# Altium schematic sheet Master_Controller.SchDoc: Master Controller
size Tabloid; PageSetup: Record=PageOptions|CenterHorizontal=True|CenterVertical=True|PrintScale=0.64|XCorrection=1.00|YCorrection=1.00|PrintKind=1|BorderSize=5000000|LeftOffset=0|BottomOffset=0|Orientation=2|PaperLength=1000|PaperWidth=1000|Scale=100|PaperSource=7|PrintQuality=-3|MediaType=1|DitherType=10|PrintScaleMode=1|PaperKind=Letter|PaperIndex=1; Organization: Midnight Sun Solar Rayce Car Team; Address1: University of Waterloo; Address2: 200 University Ave W; Address3: Waterloo, ON, Canada; Address4: N2L 3E9; SheetNumber: 3; SheetTotal: 3; Website: www.uwmidsun.com
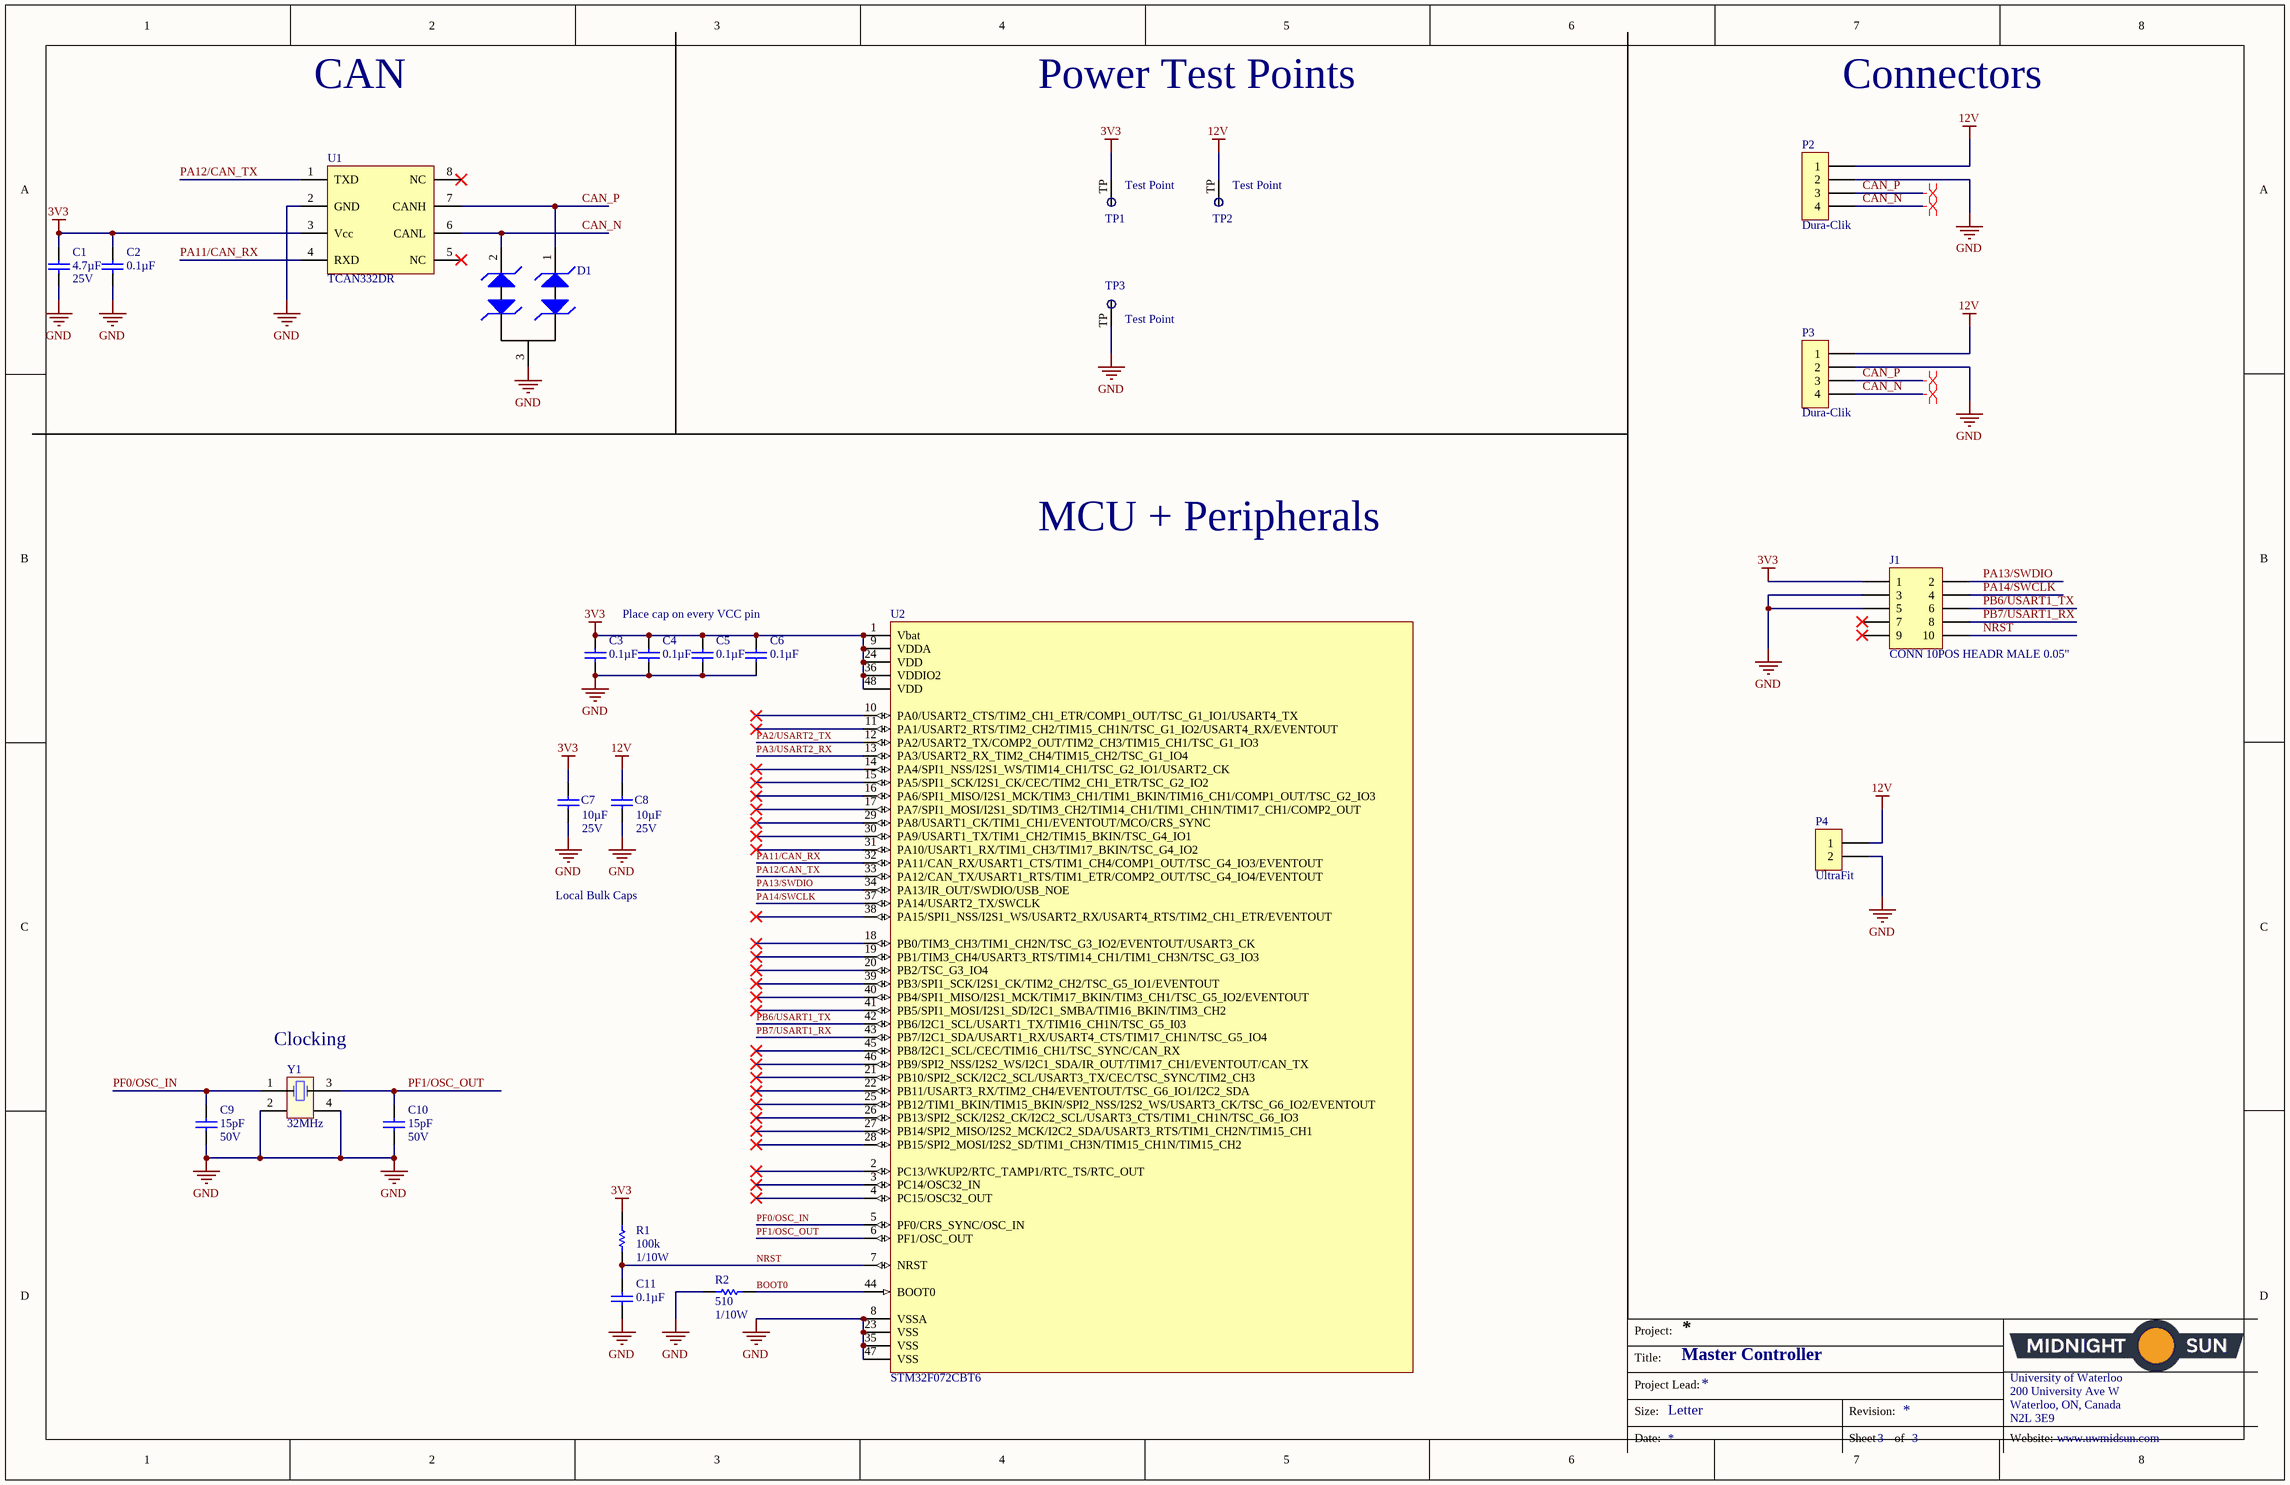
[diagram p0: Master_Controller.SchDoc]

## Parts
C1  Voltage: 25V  Capacitance: 4.7µF  [CAP, 0603]  (hidden comment: CAP CER 4.7UF 25V 10% X5R 0603)
C2  Capacitance: 0.1µF  [CAP, 0603]  (hidden comment: CAP CER 0.1UF 50V 10% X7R 0603)
C3  Capacitance: 0.1µF  [CAP, 0603]  (hidden comment: CAP CER 0.1UF 50V 10% X7R 0603)
C4  Capacitance: 0.1µF  [CAP, 0603]  (hidden comment: CAP CER 0.1UF 50V 10% X7R 0603)
C5  Capacitance: 0.1µF  [CAP, 0603]  (hidden comment: CAP CER 0.1UF 50V 10% X7R 0603)
C6  Capacitance: 0.1µF  [CAP, 0603]  (hidden comment: CAP CER 0.1UF 50V 10% X7R 0603)
C7  Voltage - Rated: 25V  Capacitance: 10µF  [CAP, 0805]  (hidden comment: CAP CER 10uF 25V 10% X5R 0805)
C8  Voltage - Rated: 25V  Capacitance: 10µF  [CAP, 0805]  (hidden comment: CAP CER 10uF 25V 10% X5R 0805)
C9  Voltage: 50V  Capacitance: 15pF  [CAP, 0603]  (hidden comment: CAP CER 15PF 50V ±5% NPO 0603)
C10  Voltage: 50V  Capacitance: 15pF  [CAP, 0603]  (hidden comment: CAP CER 15PF 50V ±5% NPO 0603)
C11  Capacitance: 0.1µF  [CAP, 0603]  (hidden comment: CAP CER 0.1UF 50V 10% X7R 0603)
D1  DIODE TVS 24VWM 70VC SOT23  [SOT23]  (value not drawn)
J1  CONN 10POS HEADR MALE 0.05"  [CONN, 10POS 0.05" Debug Header]
P2  Dura-Clik  [CONN, 4POS DURA-CLIK VERT]
P3  Dura-Clik  [CONN, 4POS DURA-CLIK VERT]
P4  Series: UltraFit  [CONN, 2POS ULTRA-FIT]  (hidden comment: CONN 2POS ULTRA-FIT 0.138")
R1  Resistance: 100k  Power: 1/10W  [RES, 0603]  (hidden comment: RES 100K OHM 5% 1/8W 0603)
R2  Resistance: 510  Power: 1/10W  [RES, 0603]  (hidden comment: RES 510 OHM 5% 1/10W 0603)
TP1  Test Point  [Test Point]
TP2  Test Point  [Test Point]
TP3  Test Point  [Test Point]
U1  Manufacturer Part Number: TCAN332DR  [TSOP65P280X145-8N]  (hidden comment: IC CAN Tranceiver TCAN332DR)
U2  Manufacturer Part Number 1: STM32F072CBT6  [TSQFP50P890X890X160-48M]  (hidden comment: IC MCU 32BIT 128KB FLASH 48LQFP)
Y1  Frequency: 32MHz  [CX2520DB CRYSTAL]  (hidden comment: CRYSTAL 32 MHz 8pF 4-SMD)

## Nets
3V3: C1.2 C2.2 C3.2 C4.2 C5.2 C6.2 C7.1 J1.1 R1.2 TP1.TP U1.3(Vcc) U2.1(Vbat) U2.9(VDDA) U2.24(VDD) U2.36(VDDIO2) U2.48(VDD)
12V: C8.1 P2.1 P3.1 P4.1 TP2.TP
GND: C1.1 C2.1 C3.1 C4.1 C5.1 C6.1 C7.2 C8.2 C9.1 C10.1 C11.1 D1.3(Common_Cathode) J1.3 J1.5 P2.2 P3.2 P4.2 R2.1 TP3.TP U1.2(GND) U2.8(VSSA) U2.23(VSS) U2.35(VSS) U2.47(VSS) Y1.2 Y1.4
BOOT0: R2.2 U2.44(BOOT0)
CAN_N: D1.2(Cathode2) P2.4 P3.4 U1.6(CANL)
CAN_P: D1.1(Cathode1) P2.3 P3.3 U1.7(CANH)
NRST: C11.2 J1.10 R1.1 U2.7(NRST)
PA2/USART2_TX: U2.12(PA2/USART2_TX/COMP2_OUT/TIM2_CH3/TIM15_CH1/TSC_G1_IO3)
PA3/USART2_RX: U2.13(PA3/USART2_RX_TIM2_CH4/TIM15_CH2/TSC_G1_IO4)
PA11/CAN_RX: U1.4(RXD) U2.32(PA11/CAN_RX/USART1_CTS/TIM1_CH4/COMP1_OUT/TSC_G4_IO3/EVENTOUT)
PA12/CAN_TX: U1.1(TXD) U2.33(PA12/CAN_TX/USART1_RTS/TIM1_ETR/COMP2_OUT/TSC_G4_IO4/EVENTOUT)
PA13/SWDIO: J1.2 U2.34(PA13/IR_OUT/SWDIO/USB_NOE)
PA14/SWCLK: J1.4 U2.37(PA14/USART2_TX/SWCLK)
PB6/USART1_TX: J1.6 U2.42(PB6/I2C1_SCL/USART1_TX/TIM16_CH1N/TSC_G5_I03)
PB7/USART1_RX: J1.8 U2.43(PB7/I2C1_SDA/USART1_RX/USART4_CTS/TIM17_CH1N/TSC_G5_IO4)
PF0/OSC_IN: C9.2 U2.5(PF0/CRS_SYNC/OSC_IN) Y1.1(OSC1)
PF1/OSC_OUT: C10.2 U2.6(PF1/OSC_OUT) Y1.3(OSC2)

Not connected (* = marked no-connect by the designer): J1 7* 9*; U1 5(NC)* 8(NC)*; U2 2(PC13/WKUP2/RTC_TAMP1/RTC_TS/RTC_OUT)* 3(PC14/OSC32_IN)* 4(PC15/OSC32_OUT)* 10(PA0/USART2_CTS/TIM2_CH1_ETR/COMP1_OUT/TSC_G1_IO1/USART4_TX)* 11(PA1/USART2_RTS/TIM2_CH2/TIM15_CH1N/TSC_G1_IO2/USART4_RX/EVENTOUT)* 14(PA4/SPI1_NSS/I2S1_WS/TIM14_CH1/TSC_G2_IO1/USART2_CK)* 15(PA5/SPI1_SCK/I2S1_CK/CEC/TIM2_CH1_ETR/TSC_G2_IO2)* 16(PA6/SPI1_MISO/I2S1_MCK/TIM3_CH1/TIM1_BKIN/TIM16_CH1/COMP1_OUT/TSC_G2_IO3)* 17(PA7/SPI1_MOSI/I2S1_SD/TIM3_CH2/TIM14_CH1/TIM1_CH1N/TIM17_CH1/COMP2_OUT)* 18(PB0/TIM3_CH3/TIM1_CH2N/TSC_G3_IO2/EVENTOUT/USART3_CK)* 19(PB1/TIM3_CH4/USART3_RTS/TIM14_CH1/TIM1_CH3N/TSC_G3_IO3)* 20(PB2/TSC_G3_IO4)* 21(PB10/SPI2_SCK/I2C2_SCL/USART3_TX/CEC/TSC_SYNC/TIM2_CH3)* 22(PB11/USART3_RX/TIM2_CH4/EVENTOUT/TSC_G6_IO1/I2C2_SDA)* 25(PB12/TIM1_BKIN/TIM15_BKIN/SPI2_NSS/I2S2_WS/USART3_CK/TSC_G6_IO2/EVENTOUT)* 26(PB13/SPI2_SCK/I2S2_CK/I2C2_SCL/USART3_CTS/TIM1_CH1N/TSC_G6_IO3)* 27(PB14/SPI2_MISO/I2S2_MCK/I2C2_SDA/USART3_RTS/TIM1_CH2N/TIM15_CH1)* 28(PB15/SPI2_MOSI/I2S2_SD/TIM1_CH3N/TIM15_CH1N/TIM15_CH2)* 29(PA8/USART1_CK/TIM1_CH1/EVENTOUT/MCO/CRS_SYNC)* 30(PA9/USART1_TX/TIM1_CH2/TIM15_BKIN/TSC_G4_IO1)* 31(PA10/USART1_RX/TIM1_CH3/TIM17_BKIN/TSC_G4_IO2)* 38(PA15/SPI1_NSS/I2S1_WS/USART2_RX/USART4_RTS/TIM2_CH1_ETR/EVENTOUT)* 39(PB3/SPI1_SCK/I2S1_CK/TIM2_CH2/TSC_G5_IO1/EVENTOUT)* 40(PB4/SPI1_MISO/I2S1_MCK/TIM17_BKIN/TIM3_CH1/TSC_G5_IO2/EVENTOUT)* 41(PB5/SPI1_MOSI/I2S1_SD/I2C1_SMBA/TIM16_BKIN/TIM3_CH2)* 45(PB8/I2C1_SCL/CEC/TIM16_CH1/TSC_SYNC/CAN_RX)* 46(PB9/SPI2_NSS/I2S2_WS/I2C1_SDA/IR_OUT/TIM17_CH1/EVENTOUT/CAN_TX)*

## Layout directives
differential pair: CAN_N, CAN_P

## Notes on the sheet
- CAN
- Power Test Points
- Connectors
- MCU + Peripherals
- Place cap on every VCC pin
- Local Bulk Caps
- (near Y1) Clocking
- Project:
- Title:
- Size:
- Project Lead:
- Letter
- Revision:
- University of Waterloo
- 200 University Ave W
- Waterloo, ON, Canada
- N2L 3E9
- Date:
- Sheet
- of
- Website:

## Library data of the parts
C1 = CAP CER 4.7UF 25V 10% X5R 0603: 4.7µF ±10% 25V Ceramic Capacitor X5R 0603 (1608 Metric); Manufacturer 1: Murata Electronics North America; Manufacturer Part Number 1: GRM188R61E475KE11D; Supplier 1: Digi-Key; Supplier Part Number 1: 490-7203-1-ND; Packaging: Cut Tape (CT); Part Status: Active; Operating Temperature: -55°C ~ 85°C; Ratings: -; Mounting Type: Surface Mount, MLCC; Package / Case: 0603 (1608 Metric); Size / Dimension: 0.063" L x 0.031" W (1.60mm x 0.80mm); Height - Seated (Max): -; Thickness (Max): 0.031" (0.80mm); Lead Spacing: -; Lead Style: -; ComponentLink1URL: http://www.murata.com/~/media/webrenewal/support/library/catalog/products/capacitor/mlcc/c02e.ashx; ComponentLink1Description: http://www.murata.com/~/media/webrenewal/support/library/catalog/products/capacitor/mlcc/c02e.ashx; Tolerance: ±10%; Temperature Coefficient: X5R
C2-C6 C11 = CAP CER 0.1UF 50V 10% X7R 0603: 0.10µF ±10% 50V Ceramic Capacitor X7R 0603 (1608 Metric); Manufacturer 1: AVX Corporation; Manufacturer Part Number 1: 06035C104KAT2A; Voltage: 50V; Supplier 1: Digi-Key; Supplier Part Number 1: 478-5052-1-ND; Packaging: Cut Tape (CT); Part Status: Active; Operating Temperature: -55°C ~ 125°C; Ratings: -; Mounting Type: Surface Mount, MLCC; Package / Case: 0603 (1608 Metric); Size / Dimension: 0.063" L x 0.032" W (1.60mm x 0.81mm); Height - Seated (Max): -; Thickness (Max): 0.035" (0.90mm); Lead Spacing: -; Lead Style: -; ComponentLink1URL: http://datasheets.avx.com/X7RDielectric.pdf; ComponentLink1Description: http://datasheets.avx.com/X7RDielectric.pdf; Tolerance: ±10%; Temperature Coefficient: X7R
C7 C8 = CAP CER 10uF 25V 10% X5R 0805: 10µF ±10% 25V Ceramic Capacitor X5R 0805 (2012 Metric); Manufacturer: Murata Electronics North America; Manufacturer Part Number: GRM21BR61E106KA73L; Supplier 1: Digi-Key; RoHS: RoHS Compliant; Category: Capacitors; Stock 1: 1695157; Packaging: Cut Tape (CT); Part Status: Active; Tolerance: ±10%; Temperature Coefficient: X5R; Operating Temperature: -55°C ~ 85°C; Features: -; Ratings: -; Applications: General Purpose; Mounting Type: Surface Mount, MLCC; Package / Case: 0805 (2012 Metric); Size / Dimension: 0.079" L x 0.049" W (2.00mm x 1.25mm); Height - Seated (Max): -; Thickness (Max): 0.053" (1.35mm); Lead Spacing: -; Lead Style: -; ComponentLink1URL: http://search.murata.co.jp/Ceramy/image/img/A01X/G101/ENG/GRM21BR61E106KA73-01.pdf; ComponentLink1Description: http://search.murata.co.jp/Ceramy/image/img/A01X/G101/ENG/GRM21BR61E106KA73-01.pdf; Supplier Part Number 1: 490-5523-1-ND; Pricing 1: 1=0.3, 10=0.214, 100=0.1008, 500=0.07068, 1000=0.05851 (CAD)
C9 C10 = CAP CER 15PF 50V ±5% NPO 0603: 15pF ±5% 50V Ceramic Capacitor C0G, NP0 0603 (1608 Metric); Manufacturer 1: Yageo; Manufacturer Part Number 1: CC0603JRNPO9BN150; Supplier 1: Digi-Key; Supplier Part Number 1: 311-1060-1-ND; Packaging: Cut Tape (CT); Part Status: Active; Operating Temperature: -55°C ~ 125°C; Ratings: -; Failure Rate: -; Mounting Type: Surface Mount, MLCC; Package / Case: 0603 (1608 Metric); Size / Dimension: 0.063" L x 0.031" W (1.60mm x 0.80mm); Height - Seated (Max): -; Thickness (Max): 0.035" (0.90mm); Lead Spacing: -; Lead Style: -; ComponentLink1URL: http://www.yageo.com/documents/recent/UPY-GP_NP0_16V-to-50V_16.pdf; ComponentLink1Description: http://www.yageo.com/documents/recent/UPY-GP_NP0_16V-to-50V_16.pdf; Tolerance: ±5%; Temperature Coefficient: C0G, NP0
D1 = DIODE TVS 24VWM 70VC SOT23: TVS DIODE 24VWM 70VC SOT23; Manufacturer 1: Nexperia USA Inc.; Manufacturer Part Number 1: PESD1CAN,215; Type: Zener; Voltage - Breakdown (Min): 25.4V; Voltage - Clamping (Max) @ Ipp: 70V; Current - Peak Pulse (10/1000µs): 3A (8/20µs); Power - Peak Pulse: 200W; Power Line Protection: No; Capacitance @ Frequency: 11pF @ 1MHz; Supplier 1: Digi-Key; Supplier Part Number 1: 1727-3817-1-ND; Packaging: Cut Tape (CT); Part Status: Active; Operating Temperature: -65°C ~ 150°C (TA); Mounting Type: Surface Mount; Package / Case: TO-236-3, SC-59, SOT-23-3; Supplier Device Package: SOT-23 (TO-236AB); ComponentLink1URL: http://assets.nexperia.com/documents/data-sheet/PESD1CAN.pdf; ComponentLink1Description: http://assets.nexperia.com/documents/data-sheet/PESD1CAN.pdf
J1 = CONN 10POS HEADR MALE 0.05": 10 Positions Header Connector 0.050" (1.27mm) Surface Mount Gold; Manufacturer 1: Amphenol FCI; Manufacturer Part Number 1: 20021121-00010C4LF; Style: Board to Board; Shrouding: Unshrouded; Number of Positions: 10; Number of Positions Loaded: All; Contact Length - Mating: 0.120" (3.05mm); Material Flammability Rating: UL94 V-0; Supplier 1: Digi-Key; Supplier Part Number 1: 609-3695-1-ND; Packaging: Cut Tape (CT); Part Status: Active; Connector Type: Header; Contact Type: Male Pin; Number of Rows: 2; Row Spacing - Mating: 0.050" (1.27mm); Mounting Type: Surface Mount; Termination: Solder; Fastening Type: -; Contact Length - Post: -; Overall Contact Length: -; Insulation Height: -; Contact Shape: Square; Contact Finish - Mating: Gold; Contact Finish Thickness - Mating: 10µin (0.25µm); Contact Finish - Post: Tin; Contact Material: Copper Alloy; Insulation Material: Thermoplastic; Operating Temperature: -; Ingress Protection: -; Insulation Color: Black; Current Rating: -; Mated Stacking Heights: -; Contact Finish Thickness - Post: 50µin (1.27µm); ComponentLink1URL: http://portal.fciconnect.com/Comergent//fci/drawing/20021121.pdf; ComponentLink1Description: http://portal.fciconnect.com/Comergent//fci/drawing/20021121.pdf; Voltage: -; Pitch - Mating: 0.050" (1.27mm)
P2 P3 = CONN 4POS DURA-CLIK 0.079": 4 Positions Header Connector 0.079" (2.00mm) Surface Mount Tin; Manufacturer: Molex, LLC; Manufacturer Part Number: 5600200420; Style: Board to Cable/Wire; Shrouding: Shrouded - 4 Wall; Number of Positions: 4; Number of Positions Loaded: All; Mated Stacking Heights: 9.3mm; Supplier 1: Digi-Key; RoHS: RoHS Compliant; Category: Connectors, Interconnects; Stock 1: 9367; Pricing 1: 1=2.23, 10=2.022, 25=1.898, 50=1.8156, 100=1.733 (CAD); Packaging: Cut Tape (CT); Part Status: Active; Connector Type: Header; Contact Type: Male Pin; Pitch - Mating: 0.079" (2.00mm); Number of Rows: 1; Row Spacing - Mating: -; Mounting Type: Surface Mount; Termination: Solder; Fastening Type: Latch Lock; Contact Length - Mating: -; Contact Length - Post: -; Overall Contact Length: -; Insulation Height: 0.315" (8.00mm); Contact Shape: Square; Contact Finish - Mating: Tin; Contact Finish Thickness - Mating: -; Contact Finish - Post: Tin; Contact Material: Copper Alloy; Insulation Material: Polyamide (PA), Nylon; Features: Solder Retention; Operating Temperature: -; Ingress Protection: -; Material Flammability Rating: -; Insulation Color: Natural; Current Rating: -; Voltage Rating: -; Contact Finish Thickness - Post: -; Applications: Automotive, Industrial; ComponentLink1URL: http://www.molex.com/pdm_docs/sd/5600200420_sd.pdf; ComponentLink1Description: http://www.molex.com/pdm_docs/sd/5600200420_sd.pdf; Supplier Part Number 1: WM10864CT-ND
P4 = CONN 2POS ULTRA-FIT 0.138": 2 Positions Header, Shrouded Connector 0.138" (3.50mm) Through Hole Gold; Manufacturer 1: Molex, LLC; Manufacturer Part Number 1: 1722861302; Style: Board to Board or Cable; Shrouding: Shrouded - 4 Wall; Number of Positions: 2; Number of Positions Loaded: All; Contact Length - Post: 0.126" (3.20mm); Material Flammability Rating: UL94 V-0; Mated Stacking Heights: 26.99mm; Voltage: 400V; Supplier 1: Digi-Key; Supplier Part Number 1: WM11673-ND; Packaging: Tray; Part Status: Active; Connector Type: Header; Contact Type: Male Pin; Pitch - Mating: 0.138" (3.50mm); Number of Rows: 1; Row Spacing - Mating: -; Mounting Type: Through Hole; Termination: Kinked Pin, Solder; Fastening Type: Latch Holder; Contact Length - Mating: -; Overall Contact Length: -; Insulation Height: 0.465" (11.80mm); Contact Shape: Square; Contact Finish - Mating: Gold; Contact Finish Thickness - Mating: 30µin (0.76µm); Contact Finish - Post: Tin; Contact Material: Copper Alloy; Insulation Material: Liquid Crystal Polymer (LCP); Operating Temperature: -40°C ~ 120°C; Ingress Protection: -; Insulation Color: Black; Current Rating: -; Contact Finish Thickness - Post: 60µin (1.52µm); ComponentLink1URL: http://www.molex.com/pdm_docs/sd/1722861302_sd.pdf; ComponentLink1Description: http://www.molex.com/pdm_docs/sd/1722861302_sd.pdf
R1 = RES 100K OHM 5% 1/8W 0603: RES SMD 100K OHM 5% 1/10W 0603; Manufacturer 1: Yageo; Manufacturer Part Number 1: RC0603JR-07100KL; Temperature Coefficient: ±100ppm/°C; Supplier 1: Digi-Key; Supplier Part Number 1: 311-100KGRCT-ND; Packaging: Cut Tape (CT); Part Status: Active; Composition: Thick Film; Operating Temperature: -55°C ~ 155°C; Package / Case: 0603 (1608 Metric); Supplier Device Package: 0603; Size / Dimension: 0.063" L x 0.031" W (1.60mm x 0.80mm); Height - Seated (Max): 0.022" (0.55mm); Failure Rate: -; ComponentLink1URL: http://www.yageo.com/documents/recent/PYu-RC_Group_51_RoHS_L_7.pdf; ComponentLink1Description: http://www.yageo.com/documents/recent/PYu-RC_Group_51_RoHS_L_7.pdf; Tolerance: ±5%
R2 = RES 510 OHM 5% 1/10W 0603: RES SMD 510 OHM 5% 1/10W 0603; Manufacturer 1: Yageo; Manufacturer Part Number 1: RC0603JR-07510RL; Temperature Coefficient: ±100ppm/°C; Supplier 1: Digi-Key; Supplier Part Number 1: 311-510GRCT-ND; Packaging: Cut Tape (CT); Part Status: Active; Composition: Thick Film; Operating Temperature: -55°C ~ 155°C; Package / Case: 0603 (1608 Metric); Supplier Device Package: 0603; Size / Dimension: 0.063" L x 0.031" W (1.60mm x 0.80mm); Height - Seated (Max): 0.022" (0.55mm); Failure Rate: -; ComponentLink1URL: http://www.yageo.com/documents/recent/PYu-RC_Group_51_RoHS_L_7.pdf; ComponentLink1Description: http://www.yageo.com/documents/recent/PYu-RC_Group_51_RoHS_L_7.pdf; Tolerance: ±5%
U1 = IC CAN Tranceiver TCAN332DR: 1/1 Transceiver CAN 8-SOIC; Supplier 1: Digi-Key; Supplier Part Number 1: 296-43711-1-ND; Digikey Part Number: 296-43711-1-ND
U2 = IC MCU 32BIT 128KB FLASH 48LQFP: ARM® Cortex®-M0 STM32 F0 Microcontroller IC 32-Bit 48MHz 128KB (128K x 8) FLASH 48-LQFP (7x7); Manufacturer 1: STMicroelectronics; Connectivity: CAN, HDMI-CEC, I²C, IrDA, LIN, SPI, UART/USART, USB; Peripherals: DMA, I²S, POR, PWM, WDT; Number of I/O: 37; RAM Size: 16K x 8; Voltage - Supply (Vcc/Vdd): 1.65 V ~ 3.6 V; Data Converters: A/D 10x12b, D/A 2x12b; Oscillator Type: Internal; Supplier 1: Digi-Key; Supplier Part Number 1: 497-14645-ND; Packaging: Tray; Part Status: Active; Core Processor: ARM® Cortex®-M0; Core Size: 32-Bit; Speed: 48MHz; Program Memory Size: 128KB (128K x 8); Program Memory Type: FLASH; EEPROM Size: -; Operating Temperature: -40°C ~ 85°C (TA); Package / Case: 48-LQFP; Supplier Device Package: 48-LQFP (7x7); ComponentLink1URL: http://www.st.com/content/ccc/resource/technical/document/datasheet/cd/46/43/83/22/d3/40/c8/DM00090510.pdf/files/DM00090510.pdf/jcr:content/translations/en.DM00090510.pdf; ComponentLink1Description: http://www.st.com/content/ccc/resource/technical/document/datasheet/cd/46/43/83/22/d3/40/c8/DM00090510.pdf/files/DM00090510.pdf/jcr:content/translations/en.DM00090510.pdf
Y1 = CRYSTAL 32 MHz 8pF 4-SMD: 32MHz ±15ppm Crystal 8pF 50 Ohm -40°C ~ 85°C AEC-Q200 Surface Mount 4-SMD, No Lead; Manufacturer 1: AVX Corp/Kyocera Corp; Manufacturer Part Number 1: CX2520DB32000D0GPSC1; Frequency Stability: ±50ppm; ESR (Equivalent Series Resistance): 50 Ohm; Operating Mode: Fundamental; Supplier 1: Digi-Key; Supplier Part Number 1: 1253-1730-1-ND; Packaging: Cut Tape (CT); Part Status: Active; Type: MHz Crystal; Frequency Tolerance: ±15ppm; Operating Temperature: -40°C ~ 85°C; Ratings: AEC-Q200; Mounting Type: Surface Mount; Package / Case: 4-SMD, No Lead; Size / Dimension: 0.098" L x 0.079" W (2.50mm x 2.00mm); Height - Seated (Max): 0.022" (0.55mm); ComponentLink1URL: http://media.digikey.com/pdf/Data%20Sheets/AVX%20PDFs/CX2520DB_USY1M-H1-16428-00_Spec.pdf; ComponentLink1Description: http://media.digikey.com/pdf/Data%20Sheets/AVX%20PDFs/CX2520DB_USY1M-H1-16428-00_Spec.pdf; Load Capacitance: 8pF